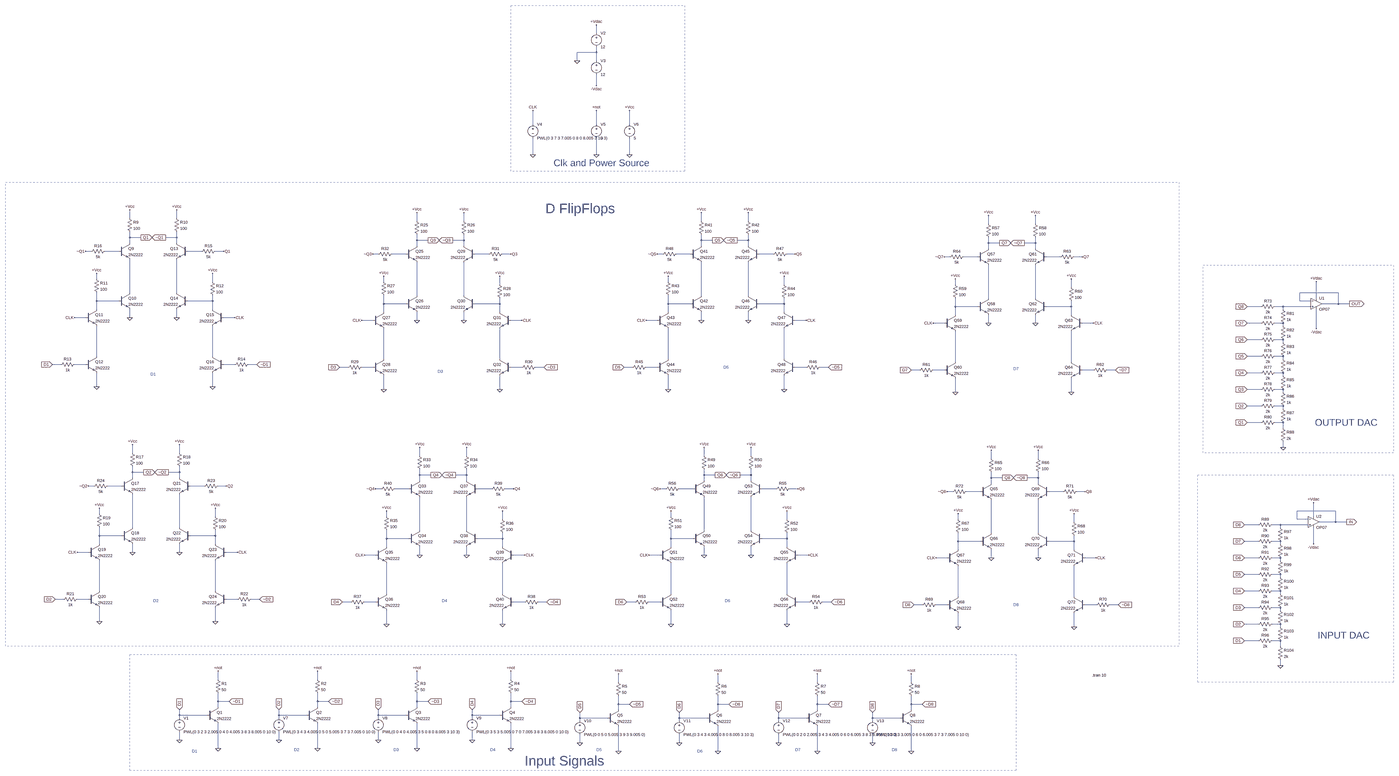
[diagram p0: schematic Memory_8Bits_FINAL.asc, whole sheet]
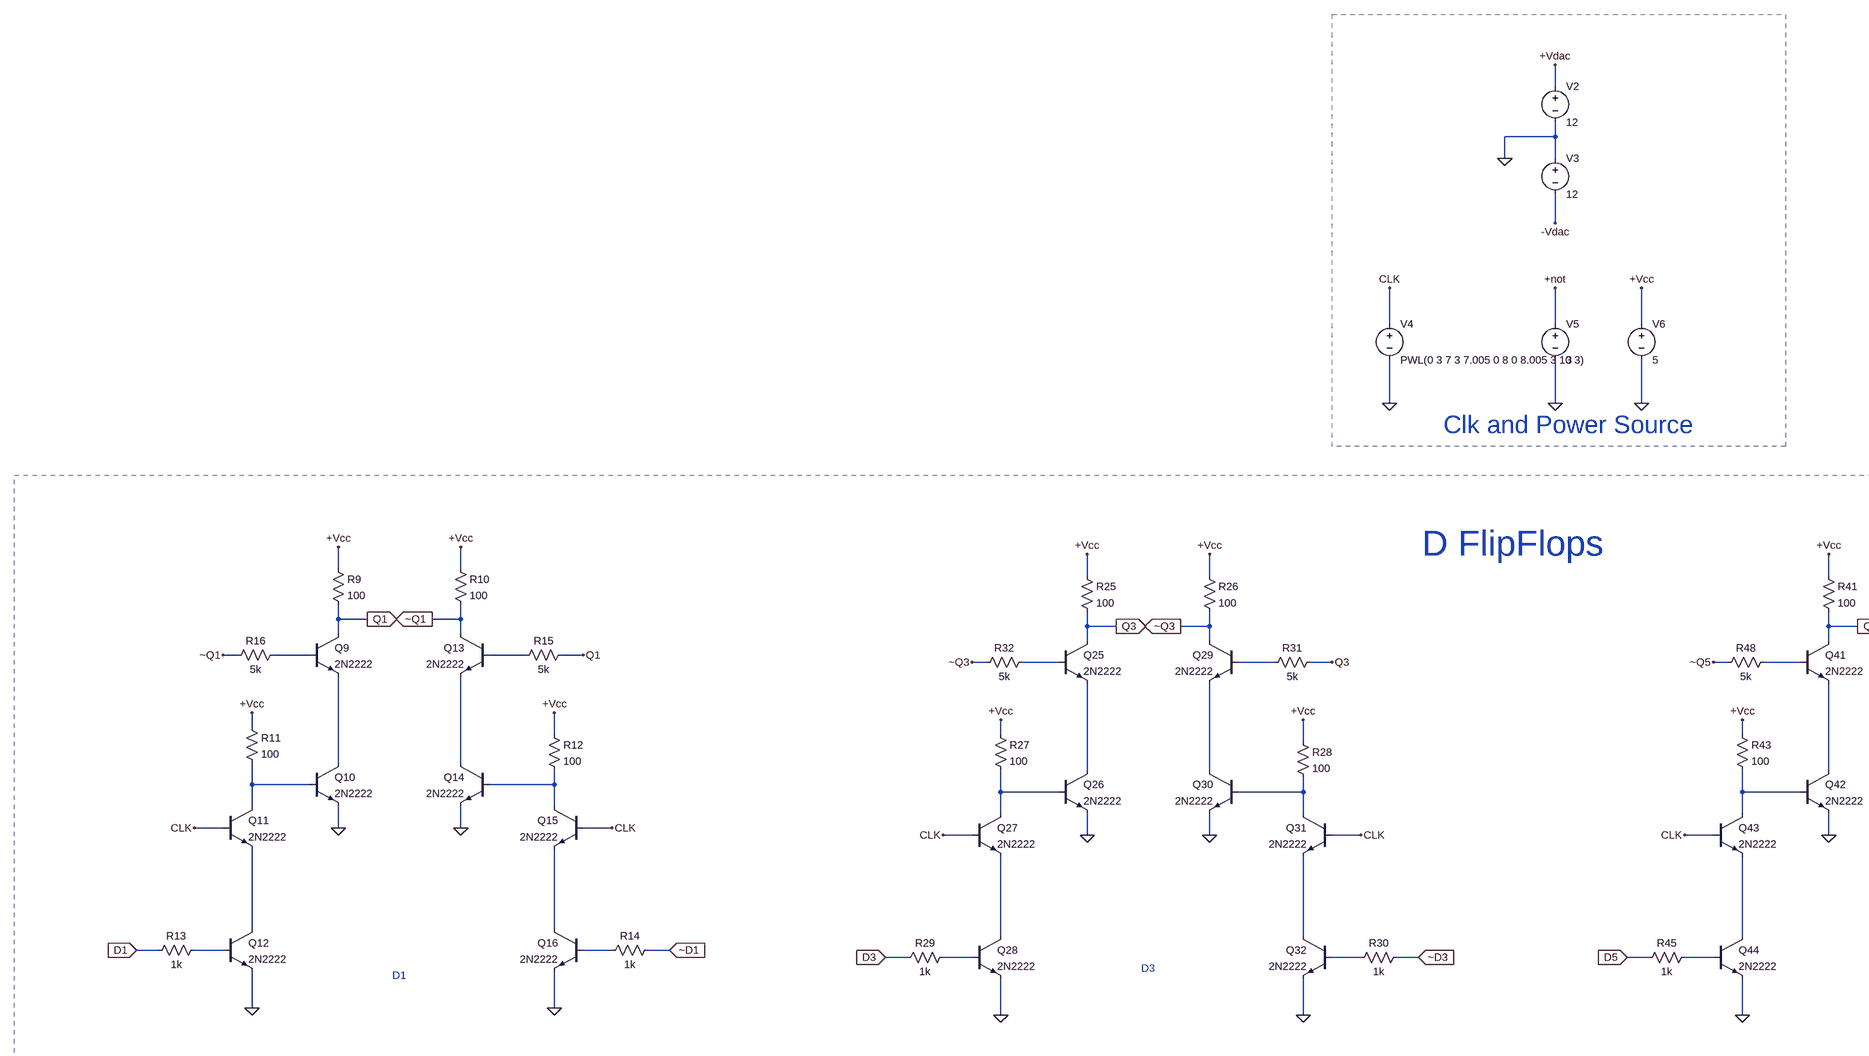
[diagram p1: schematic Memory_8Bits_FINAL.asc, part, row 1 of 2, column 1 of 2]
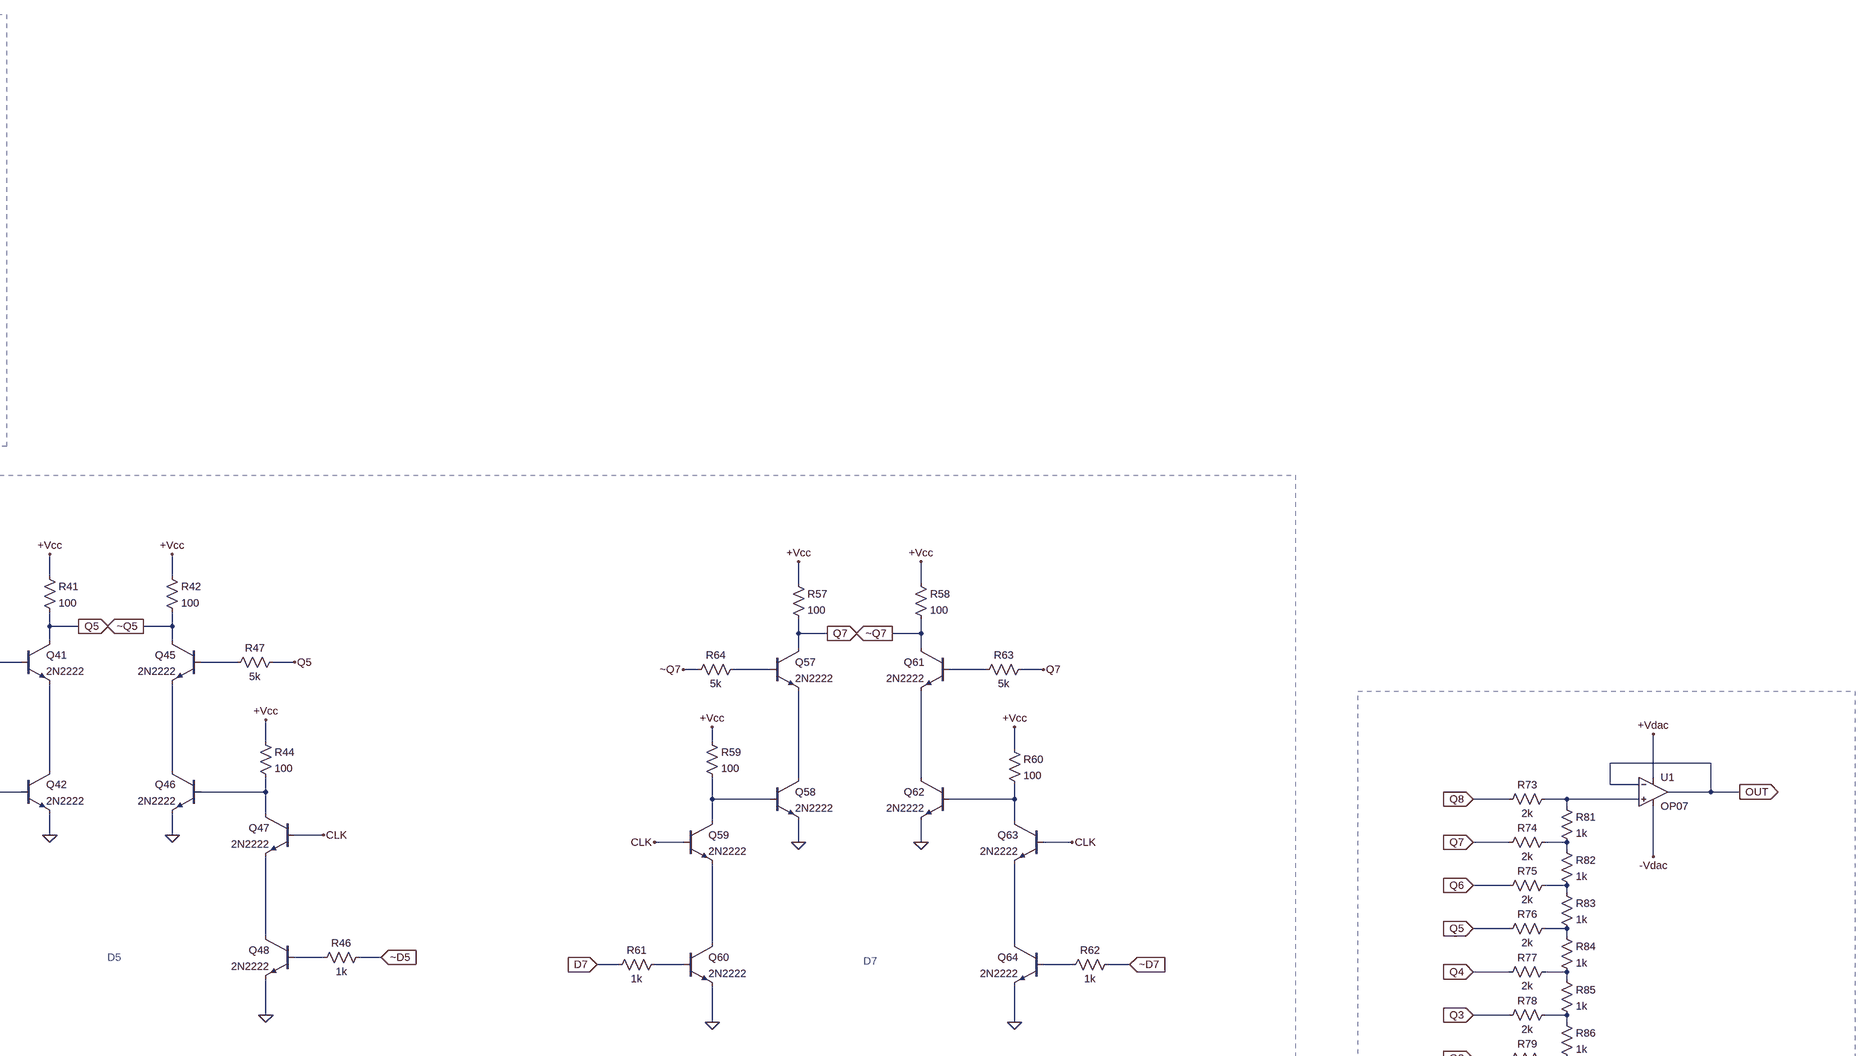
[diagram p2: schematic Memory_8Bits_FINAL.asc, part, row 1 of 2, column 2 of 2]
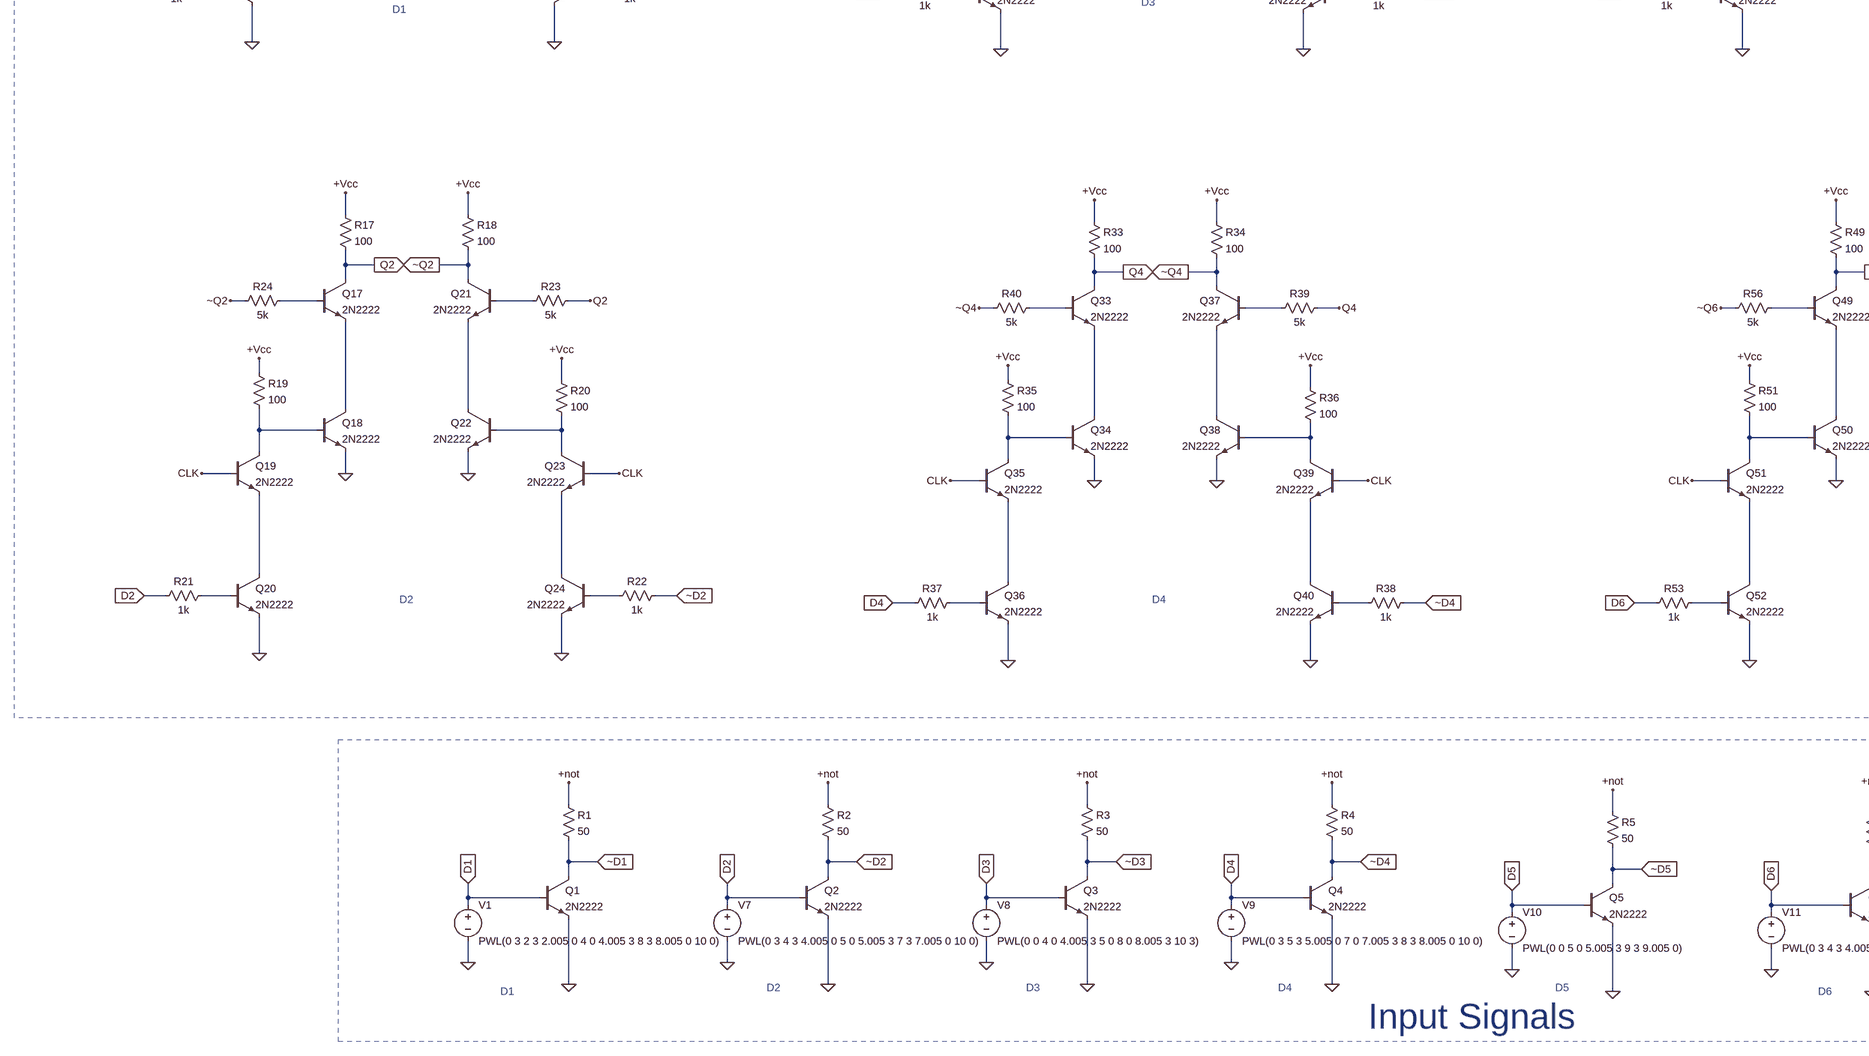
[diagram p3: schematic Memory_8Bits_FINAL.asc, part, row 2 of 2, column 1 of 2]
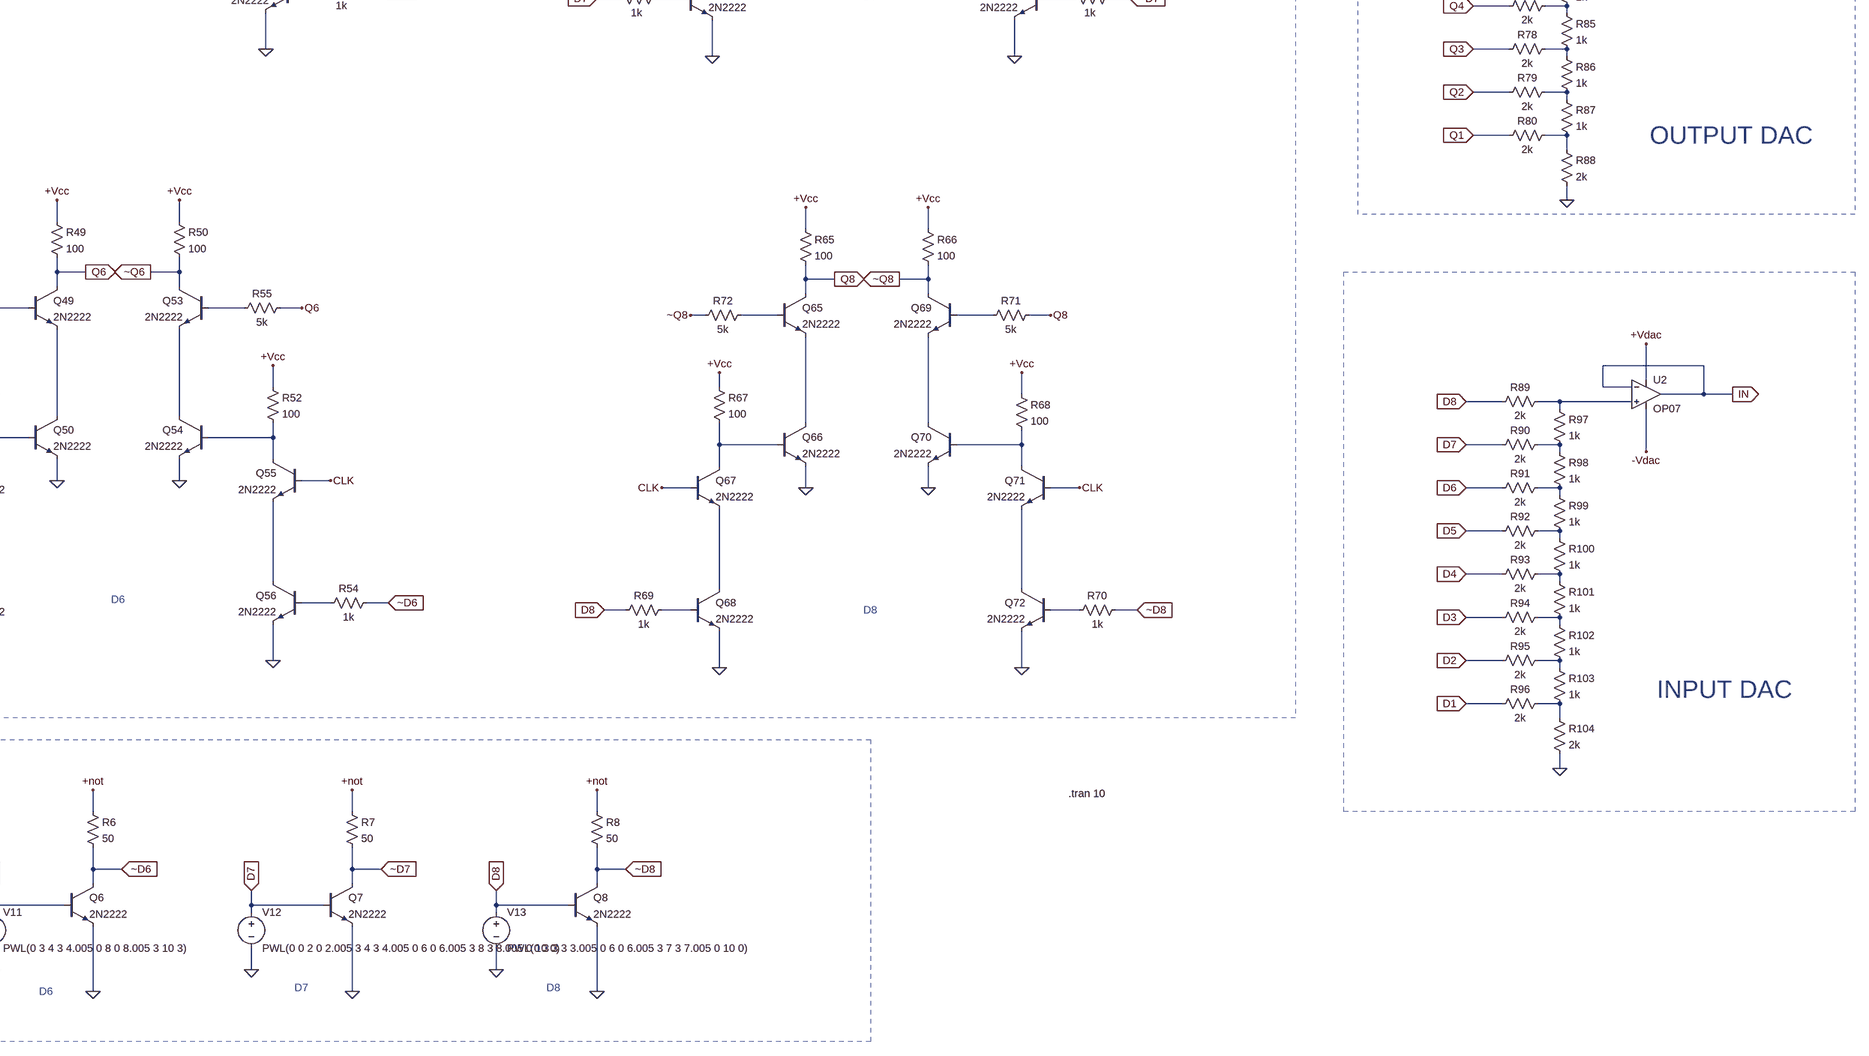
[diagram p4: schematic Memory_8Bits_FINAL.asc, part, row 2 of 2, column 2 of 2]
Memory_8Bits_FINAL.asc, the LTspice schematic file:
Version 4
SHEET 1 6340 4508
WIRE 1552 -160 1552 -208
WIRE 1552 -48 1552 -80
WIRE 1552 -48 1440 -48
WIRE 1440 0 1440 -48
WIRE 1552 0 1552 -48
WIRE 1552 144 1552 80
WIRE 1184 368 1184 288
WIRE 1552 368 1552 288
WIRE 1744 368 1744 288
WIRE 1184 544 1184 448
WIRE 1552 544 1552 448
WIRE 1744 544 1744 448
WIRE -1152 912 -1152 864
WIRE -880 912 -880 864
WIRE 512 928 512 880
WIRE 784 928 784 880
WIRE 2160 928 2160 880
WIRE 2432 928 2432 880
WIRE 3824 944 3824 896
WIRE 4096 944 4096 896
WIRE -1152 1024 -1152 992
WIRE -1088 1024 -1152 1024
WIRE -880 1024 -880 992
WIRE -880 1024 -944 1024
WIRE 512 1040 512 1008
WIRE 576 1040 512 1040
WIRE 784 1040 784 1008
WIRE 784 1040 720 1040
WIRE 2160 1040 2160 1008
WIRE 2224 1040 2160 1040
WIRE 2432 1040 2432 1008
WIRE 2432 1040 2368 1040
WIRE -1152 1056 -1152 1024
WIRE -880 1056 -880 1024
WIRE 3824 1056 3824 1024
WIRE 3888 1056 3824 1056
WIRE 4096 1056 4096 1024
WIRE 4096 1056 4032 1056
WIRE 512 1072 512 1040
WIRE 784 1072 784 1040
WIRE 2160 1072 2160 1040
WIRE 2432 1072 2432 1040
WIRE 3824 1088 3824 1056
WIRE 4096 1088 4096 1056
WIRE -1376 1104 -1408 1104
WIRE -1216 1104 -1296 1104
WIRE -736 1104 -816 1104
WIRE -608 1104 -656 1104
WIRE 288 1120 256 1120
WIRE 448 1120 368 1120
WIRE 928 1120 848 1120
WIRE 1056 1120 1008 1120
WIRE 1936 1120 1904 1120
WIRE 2096 1120 2016 1120
WIRE 2576 1120 2496 1120
WIRE 2704 1120 2656 1120
WIRE 3600 1136 3568 1136
WIRE 3760 1136 3680 1136
WIRE 4240 1136 4160 1136
WIRE 4368 1136 4320 1136
WIRE -1344 1264 -1344 1232
WIRE -672 1280 -672 1232
WIRE 320 1280 320 1248
WIRE 1968 1280 1968 1248
WIRE 992 1296 992 1248
WIRE 2640 1296 2640 1248
WIRE 3632 1296 3632 1264
WIRE 4304 1312 4304 1264
WIRE -1152 1344 -1152 1152
WIRE -880 1344 -880 1152
WIRE 5968 1344 5744 1344
WIRE 512 1360 512 1168
WIRE 784 1360 784 1168
WIRE 2160 1360 2160 1168
WIRE 2432 1360 2432 1168
WIRE 3824 1376 3824 1184
WIRE 4096 1376 4096 1184
WIRE 5840 1376 5840 1280
WIRE -1344 1392 -1344 1344
WIRE -1216 1392 -1344 1392
WIRE -672 1392 -672 1360
WIRE -672 1392 -816 1392
WIRE 5744 1392 5744 1344
WIRE 5808 1392 5744 1392
WIRE 320 1408 320 1360
WIRE 448 1408 320 1408
WIRE 992 1408 992 1376
WIRE 992 1408 848 1408
WIRE 1968 1408 1968 1360
WIRE 2096 1408 1968 1408
WIRE 2640 1408 2640 1376
WIRE 2640 1408 2496 1408
WIRE 5968 1408 5968 1344
WIRE 5968 1408 5872 1408
WIRE 6032 1408 5968 1408
WIRE 3632 1424 3632 1376
WIRE 3760 1424 3632 1424
WIRE 4304 1424 4304 1392
WIRE 4304 1424 4160 1424
WIRE 5520 1424 5440 1424
WIRE 5648 1424 5600 1424
WIRE 5808 1424 5648 1424
WIRE -1344 1440 -1344 1392
WIRE -672 1440 -672 1392
WIRE 5648 1440 5648 1424
WIRE 320 1456 320 1408
WIRE 992 1456 992 1408
WIRE 1968 1456 1968 1408
WIRE 2640 1456 2640 1408
WIRE 3632 1472 3632 1424
WIRE 4304 1472 4304 1424
WIRE -1408 1488 -1472 1488
WIRE -1152 1488 -1152 1440
WIRE -880 1488 -880 1440
WIRE -544 1488 -608 1488
WIRE 256 1504 192 1504
WIRE 512 1504 512 1456
WIRE 784 1504 784 1456
WIRE 1120 1504 1056 1504
WIRE 1904 1504 1840 1504
WIRE 2160 1504 2160 1456
WIRE 2432 1504 2432 1456
WIRE 2768 1504 2704 1504
WIRE 3568 1520 3504 1520
WIRE 3824 1520 3824 1472
WIRE 4096 1520 4096 1472
WIRE 4432 1520 4368 1520
WIRE 5520 1520 5440 1520
WIRE 5648 1520 5600 1520
WIRE 5648 1536 5648 1520
WIRE 5840 1552 5840 1440
WIRE 5520 1616 5440 1616
WIRE 5648 1616 5600 1616
WIRE 5648 1632 5648 1616
WIRE -1344 1712 -1344 1536
WIRE -672 1712 -672 1536
WIRE 5520 1712 5440 1712
WIRE 5648 1712 5600 1712
WIRE 320 1728 320 1552
WIRE 992 1728 992 1552
WIRE 1968 1728 1968 1552
WIRE 2640 1728 2640 1552
WIRE 5648 1728 5648 1712
WIRE 3632 1744 3632 1568
WIRE 4304 1744 4304 1568
WIRE -1552 1760 -1600 1760
WIRE -1408 1760 -1472 1760
WIRE -544 1760 -608 1760
WIRE -416 1760 -464 1760
WIRE 112 1776 64 1776
WIRE 256 1776 192 1776
WIRE 1120 1776 1056 1776
WIRE 1248 1776 1200 1776
WIRE 1760 1776 1712 1776
WIRE 1904 1776 1840 1776
WIRE 2768 1776 2704 1776
WIRE 2896 1776 2848 1776
WIRE 3424 1792 3376 1792
WIRE 3568 1792 3504 1792
WIRE 4432 1792 4368 1792
WIRE 4560 1792 4512 1792
WIRE 5520 1808 5440 1808
WIRE 5648 1808 5600 1808
WIRE 5648 1824 5648 1808
WIRE -1344 1888 -1344 1808
WIRE -672 1888 -672 1808
WIRE 320 1904 320 1824
WIRE 992 1904 992 1824
WIRE 1968 1904 1968 1824
WIRE 2640 1904 2640 1824
WIRE 5520 1904 5440 1904
WIRE 5648 1904 5600 1904
WIRE 3632 1920 3632 1840
WIRE 4304 1920 4304 1840
WIRE 5648 1920 5648 1904
WIRE 5520 2000 5440 2000
WIRE 5648 2000 5600 2000
WIRE 5648 2016 5648 2000
WIRE 5520 2096 5440 2096
WIRE 5648 2096 5600 2096
WIRE 5648 2128 5648 2096
WIRE 5648 2240 5648 2208
WIRE -1136 2272 -1136 2224
WIRE -864 2272 -864 2224
WIRE 528 2288 528 2240
WIRE 800 2288 800 2240
WIRE 2176 2288 2176 2240
WIRE 2448 2288 2448 2240
WIRE 3840 2304 3840 2256
WIRE 4112 2304 4112 2256
WIRE -1136 2384 -1136 2352
WIRE -1072 2384 -1136 2384
WIRE -864 2384 -864 2352
WIRE -864 2384 -928 2384
WIRE 528 2400 528 2368
WIRE 592 2400 528 2400
WIRE 800 2400 800 2368
WIRE 800 2400 736 2400
WIRE 2176 2400 2176 2368
WIRE 2240 2400 2176 2400
WIRE 2448 2400 2448 2368
WIRE 2448 2400 2384 2400
WIRE -1136 2416 -1136 2384
WIRE -864 2416 -864 2384
WIRE 3840 2416 3840 2384
WIRE 3904 2416 3840 2416
WIRE 4112 2416 4112 2384
WIRE 4112 2416 4048 2416
WIRE 528 2432 528 2400
WIRE 800 2432 800 2400
WIRE 2176 2432 2176 2400
WIRE 2448 2432 2448 2400
WIRE 3840 2448 3840 2416
WIRE 4112 2448 4112 2416
WIRE -1360 2464 -1392 2464
WIRE -1200 2464 -1280 2464
WIRE -720 2464 -800 2464
WIRE -592 2464 -640 2464
WIRE 304 2480 272 2480
WIRE 464 2480 384 2480
WIRE 944 2480 864 2480
WIRE 1072 2480 1024 2480
WIRE 1952 2480 1920 2480
WIRE 2112 2480 2032 2480
WIRE 2592 2480 2512 2480
WIRE 2720 2480 2672 2480
WIRE 3616 2496 3584 2496
WIRE 3776 2496 3696 2496
WIRE 4256 2496 4176 2496
WIRE 4384 2496 4336 2496
WIRE 5952 2608 5728 2608
WIRE -1328 2624 -1328 2592
WIRE -656 2640 -656 2592
WIRE 336 2640 336 2608
WIRE 1984 2640 1984 2608
WIRE 5824 2640 5824 2560
WIRE 1008 2656 1008 2608
WIRE 2656 2656 2656 2608
WIRE 3648 2656 3648 2624
WIRE 5728 2656 5728 2608
WIRE 5792 2656 5728 2656
WIRE 4320 2672 4320 2624
WIRE 5952 2672 5952 2608
WIRE 5952 2672 5856 2672
WIRE 6016 2672 5952 2672
WIRE 5504 2688 5424 2688
WIRE 5632 2688 5584 2688
WIRE 5792 2688 5632 2688
WIRE -1136 2704 -1136 2512
WIRE -864 2704 -864 2512
WIRE 5632 2704 5632 2688
WIRE 528 2720 528 2528
WIRE 800 2720 800 2528
WIRE 2176 2720 2176 2528
WIRE 2448 2720 2448 2528
WIRE 3840 2736 3840 2544
WIRE 4112 2736 4112 2544
WIRE -1328 2752 -1328 2704
WIRE -1200 2752 -1328 2752
WIRE -656 2752 -656 2720
WIRE -656 2752 -800 2752
WIRE 336 2768 336 2720
WIRE 464 2768 336 2768
WIRE 1008 2768 1008 2736
WIRE 1008 2768 864 2768
WIRE 1984 2768 1984 2720
WIRE 2112 2768 1984 2768
WIRE 2656 2768 2656 2736
WIRE 2656 2768 2512 2768
WIRE 3648 2784 3648 2736
WIRE 3776 2784 3648 2784
WIRE 4320 2784 4320 2752
WIRE 4320 2784 4176 2784
WIRE 5504 2784 5424 2784
WIRE 5632 2784 5584 2784
WIRE -1328 2800 -1328 2752
WIRE -656 2800 -656 2752
WIRE 5632 2800 5632 2784
WIRE 5824 2800 5824 2704
WIRE 336 2816 336 2768
WIRE 1008 2816 1008 2768
WIRE 1984 2816 1984 2768
WIRE 2656 2816 2656 2768
WIRE 3648 2832 3648 2784
WIRE 4320 2832 4320 2784
WIRE -1392 2848 -1456 2848
WIRE -1136 2848 -1136 2800
WIRE -864 2848 -864 2800
WIRE -528 2848 -592 2848
WIRE 272 2864 208 2864
WIRE 528 2864 528 2816
WIRE 800 2864 800 2816
WIRE 1136 2864 1072 2864
WIRE 1920 2864 1856 2864
WIRE 2176 2864 2176 2816
WIRE 2448 2864 2448 2816
WIRE 2784 2864 2720 2864
WIRE 3584 2880 3520 2880
WIRE 3840 2880 3840 2832
WIRE 4112 2880 4112 2832
WIRE 4448 2880 4384 2880
WIRE 5504 2880 5424 2880
WIRE 5632 2880 5584 2880
WIRE 5632 2896 5632 2880
WIRE 5504 2976 5424 2976
WIRE 5632 2976 5584 2976
WIRE 5632 2992 5632 2976
WIRE -1328 3072 -1328 2896
WIRE -656 3072 -656 2896
WIRE 5504 3072 5424 3072
WIRE 5632 3072 5584 3072
WIRE 336 3088 336 2912
WIRE 1008 3088 1008 2912
WIRE 1984 3088 1984 2912
WIRE 2656 3088 2656 2912
WIRE 5632 3088 5632 3072
WIRE 3648 3104 3648 2928
WIRE 4320 3104 4320 2928
WIRE -1536 3120 -1584 3120
WIRE -1392 3120 -1456 3120
WIRE -528 3120 -592 3120
WIRE -400 3120 -448 3120
WIRE 128 3136 80 3136
WIRE 272 3136 208 3136
WIRE 1136 3136 1072 3136
WIRE 1264 3136 1216 3136
WIRE 1776 3136 1728 3136
WIRE 1920 3136 1856 3136
WIRE 2784 3136 2720 3136
WIRE 2912 3136 2864 3136
WIRE 3440 3152 3392 3152
WIRE 3584 3152 3520 3152
WIRE 4448 3152 4384 3152
WIRE 4576 3152 4528 3152
WIRE 5504 3168 5424 3168
WIRE 5632 3168 5584 3168
WIRE 5632 3184 5632 3168
WIRE -1328 3248 -1328 3168
WIRE -656 3248 -656 3168
WIRE 336 3264 336 3184
WIRE 1008 3264 1008 3184
WIRE 1984 3264 1984 3184
WIRE 2656 3264 2656 3184
WIRE 5504 3264 5424 3264
WIRE 5632 3264 5584 3264
WIRE 3648 3280 3648 3200
WIRE 4320 3280 4320 3200
WIRE 5632 3280 5632 3264
WIRE 5504 3360 5424 3360
WIRE 5632 3360 5584 3360
WIRE 5632 3392 5632 3360
WIRE 5632 3504 5632 3472
WIRE -640 3584 -640 3536
WIRE -64 3584 -64 3536
WIRE 512 3584 512 3536
WIRE 1056 3584 1056 3536
WIRE 1680 3600 1680 3552
WIRE 2256 3600 2256 3552
WIRE 2832 3600 2832 3552
WIRE 3376 3600 3376 3552
WIRE -640 3712 -640 3664
WIRE -576 3712 -640 3712
WIRE -64 3712 -64 3664
WIRE 0 3712 -64 3712
WIRE 512 3712 512 3664
WIRE 576 3712 512 3712
WIRE 1056 3712 1056 3664
WIRE 1120 3712 1056 3712
WIRE 1680 3728 1680 3680
WIRE 1744 3728 1680 3728
WIRE 2256 3728 2256 3680
WIRE 2320 3728 2256 3728
WIRE 2832 3728 2832 3680
WIRE 2896 3728 2832 3728
WIRE 3376 3728 3376 3680
WIRE 3440 3728 3376 3728
WIRE -640 3744 -640 3712
WIRE -64 3744 -64 3712
WIRE 512 3744 512 3712
WIRE 1056 3744 1056 3712
WIRE 1680 3760 1680 3728
WIRE 2256 3760 2256 3728
WIRE 2832 3760 2832 3728
WIRE 3376 3760 3376 3728
WIRE -864 3792 -864 3760
WIRE -704 3792 -864 3792
WIRE -288 3792 -288 3760
WIRE -128 3792 -288 3792
WIRE 288 3792 288 3760
WIRE 448 3792 288 3792
WIRE 832 3792 832 3760
WIRE 992 3792 832 3792
WIRE -864 3808 -864 3792
WIRE -288 3808 -288 3792
WIRE 288 3808 288 3792
WIRE 832 3808 832 3792
WIRE 1456 3808 1456 3776
WIRE 1616 3808 1456 3808
WIRE 2032 3808 2032 3776
WIRE 2192 3808 2032 3808
WIRE 2608 3808 2608 3776
WIRE 2768 3808 2608 3808
WIRE 3152 3808 3152 3776
WIRE 3312 3808 3152 3808
WIRE 1456 3824 1456 3808
WIRE 2032 3824 2032 3808
WIRE 2608 3824 2608 3808
WIRE 3152 3824 3152 3808
WIRE -864 3936 -864 3888
WIRE -288 3936 -288 3888
WIRE 288 3936 288 3888
WIRE 832 3936 832 3888
WIRE 1456 3952 1456 3904
WIRE 2032 3952 2032 3904
WIRE 2608 3952 2608 3904
WIRE 3152 3952 3152 3904
WIRE -640 3984 -640 3840
WIRE -64 3984 -64 3840
WIRE 512 3984 512 3840
WIRE 1056 3984 1056 3840
WIRE 1680 4000 1680 3856
WIRE 2256 4000 2256 3856
WIRE 2832 4000 2832 3856
WIRE 3376 4000 3376 3856
FLAG -640 3984 0
FLAG -864 3936 0
FLAG 1440 0 0
FLAG 1552 -208 +Vdac
FLAG 1552 144 -Vdac
FLAG 1184 544 0
FLAG 1552 544 0
FLAG 1744 544 0
FLAG 1184 288 CLK
FLAG 1552 288 +not
FLAG 1744 288 +Vcc
FLAG -640 3536 +not
FLAG -864 3760 D1
IOPIN -864 3760 In
FLAG -576 3712 ~D1
IOPIN -576 3712 In
FLAG -64 3984 0
FLAG -288 3936 0
FLAG -64 3536 +not
FLAG -288 3760 D2
IOPIN -288 3760 In
FLAG 0 3712 ~D2
IOPIN 0 3712 In
FLAG 512 3984 0
FLAG 288 3936 0
FLAG 512 3536 +not
FLAG 288 3760 D3
IOPIN 288 3760 In
FLAG 576 3712 ~D3
IOPIN 576 3712 In
FLAG 1056 3984 0
FLAG 832 3936 0
FLAG 1056 3536 +not
FLAG 832 3760 D4
IOPIN 832 3760 In
FLAG 1120 3712 ~D4
IOPIN 1120 3712 In
FLAG 1680 4000 0
FLAG 1456 3952 0
FLAG 1680 3552 +not
FLAG 1456 3776 D5
IOPIN 1456 3776 In
FLAG 1744 3728 ~D5
IOPIN 1744 3728 In
FLAG 2256 4000 0
FLAG 2032 3952 0
FLAG 2256 3552 +not
FLAG 2032 3776 D6
IOPIN 2032 3776 In
FLAG 2320 3728 ~D6
IOPIN 2320 3728 In
FLAG 2832 4000 0
FLAG 2608 3952 0
FLAG 2832 3552 +not
FLAG 2608 3776 D7
IOPIN 2608 3776 In
FLAG 2896 3728 ~D7
IOPIN 2896 3728 In
FLAG 3376 4000 0
FLAG 3152 3952 0
FLAG 3376 3552 +not
FLAG 3152 3776 D8
IOPIN 3152 3776 In
FLAG 3440 3728 ~D8
IOPIN 3440 3728 In
FLAG -1152 1488 0
FLAG -880 1488 0
FLAG -1344 1888 0
FLAG -672 1888 0
FLAG -1344 1232 +Vcc
FLAG -1152 864 +Vcc
FLAG -880 864 +Vcc
FLAG -672 1232 +Vcc
FLAG -1600 1760 D1
IOPIN -1600 1760 In
FLAG -416 1760 ~D1
IOPIN -416 1760 In
FLAG -1472 1488 CLK
FLAG -544 1488 CLK
FLAG -1088 1024 Q1
IOPIN -1088 1024 Out
FLAG -944 1024 ~Q1
IOPIN -944 1024 Out
FLAG -1408 1104 ~Q1
FLAG -608 1104 Q1
FLAG -1136 2848 0
FLAG -864 2848 0
FLAG -1328 3248 0
FLAG -656 3248 0
FLAG -1328 2592 +Vcc
FLAG -1136 2224 +Vcc
FLAG -864 2224 +Vcc
FLAG -656 2592 +Vcc
FLAG -1584 3120 D2
IOPIN -1584 3120 In
FLAG -400 3120 ~D2
IOPIN -400 3120 In
FLAG -1456 2848 CLK
FLAG -528 2848 CLK
FLAG -1072 2384 Q2
IOPIN -1072 2384 Out
FLAG -928 2384 ~Q2
IOPIN -928 2384 Out
FLAG -1392 2464 ~Q2
FLAG -592 2464 Q2
FLAG 512 1504 0
FLAG 784 1504 0
FLAG 320 1904 0
FLAG 992 1904 0
FLAG 320 1248 +Vcc
FLAG 512 880 +Vcc
FLAG 784 880 +Vcc
FLAG 992 1248 +Vcc
FLAG 64 1776 D3
IOPIN 64 1776 In
FLAG 1248 1776 ~D3
IOPIN 1248 1776 In
FLAG 192 1504 CLK
FLAG 1120 1504 CLK
FLAG 576 1040 Q3
IOPIN 576 1040 Out
FLAG 720 1040 ~Q3
IOPIN 720 1040 Out
FLAG 256 1120 ~Q3
FLAG 1056 1120 Q3
FLAG 528 2864 0
FLAG 800 2864 0
FLAG 336 3264 0
FLAG 1008 3264 0
FLAG 336 2608 +Vcc
FLAG 528 2240 +Vcc
FLAG 800 2240 +Vcc
FLAG 1008 2608 +Vcc
FLAG 80 3136 D4
IOPIN 80 3136 In
FLAG 1264 3136 ~D4
IOPIN 1264 3136 In
FLAG 208 2864 CLK
FLAG 1136 2864 CLK
FLAG 592 2400 Q4
IOPIN 592 2400 Out
FLAG 736 2400 ~Q4
IOPIN 736 2400 Out
FLAG 272 2480 ~Q4
FLAG 1072 2480 Q4
FLAG 2160 1504 0
FLAG 2432 1504 0
FLAG 1968 1904 0
FLAG 2640 1904 0
FLAG 1968 1248 +Vcc
FLAG 2160 880 +Vcc
FLAG 2432 880 +Vcc
FLAG 2640 1248 +Vcc
FLAG 1712 1776 D5
IOPIN 1712 1776 In
FLAG 2896 1776 ~D5
IOPIN 2896 1776 In
FLAG 1840 1504 CLK
FLAG 2768 1504 CLK
FLAG 2224 1040 Q5
IOPIN 2224 1040 Out
FLAG 2368 1040 ~Q5
IOPIN 2368 1040 Out
FLAG 1904 1120 ~Q5
FLAG 2704 1120 Q5
FLAG 2176 2864 0
FLAG 2448 2864 0
FLAG 1984 3264 0
FLAG 2656 3264 0
FLAG 1984 2608 +Vcc
FLAG 2176 2240 +Vcc
FLAG 2448 2240 +Vcc
FLAG 2656 2608 +Vcc
FLAG 1728 3136 D6
IOPIN 1728 3136 In
FLAG 2912 3136 ~D6
IOPIN 2912 3136 In
FLAG 1856 2864 CLK
FLAG 2784 2864 CLK
FLAG 2240 2400 Q6
IOPIN 2240 2400 Out
FLAG 2384 2400 ~Q6
IOPIN 2384 2400 Out
FLAG 1920 2480 ~Q6
FLAG 2720 2480 Q6
FLAG 3824 1520 0
FLAG 4096 1520 0
FLAG 3632 1920 0
FLAG 4304 1920 0
FLAG 3632 1264 +Vcc
FLAG 3824 896 +Vcc
FLAG 4096 896 +Vcc
FLAG 4304 1264 +Vcc
FLAG 3376 1792 D7
IOPIN 3376 1792 In
FLAG 4560 1792 ~D7
IOPIN 4560 1792 In
FLAG 3504 1520 CLK
FLAG 4432 1520 CLK
FLAG 3888 1056 Q7
IOPIN 3888 1056 Out
FLAG 4032 1056 ~Q7
IOPIN 4032 1056 Out
FLAG 3568 1136 ~Q7
FLAG 4368 1136 Q7
FLAG 3840 2880 0
FLAG 4112 2880 0
FLAG 3648 3280 0
FLAG 4320 3280 0
FLAG 3648 2624 +Vcc
FLAG 3840 2256 +Vcc
FLAG 4112 2256 +Vcc
FLAG 4320 2624 +Vcc
FLAG 3392 3152 D8
IOPIN 3392 3152 In
FLAG 4576 3152 ~D8
IOPIN 4576 3152 In
FLAG 3520 2880 CLK
FLAG 4448 2880 CLK
FLAG 3904 2416 Q8
IOPIN 3904 2416 Out
FLAG 4048 2416 ~Q8
IOPIN 4048 2416 Out
FLAG 3584 2496 ~Q8
FLAG 4384 2496 Q8
FLAG 5840 1280 +Vdac
FLAG 5824 2560 +Vdac
FLAG 5840 1552 -Vdac
FLAG 5824 2800 -Vdac
FLAG 6016 2672 IN
IOPIN 6016 2672 Out
FLAG 6032 1408 OUT
IOPIN 6032 1408 Out
FLAG 5648 2240 0
FLAG 5440 2096 Q1
IOPIN 5440 2096 In
FLAG 5440 2000 Q2
IOPIN 5440 2000 In
FLAG 5440 1904 Q3
IOPIN 5440 1904 In
FLAG 5440 1808 Q4
IOPIN 5440 1808 In
FLAG 5440 1712 Q5
IOPIN 5440 1712 In
FLAG 5440 1616 Q6
IOPIN 5440 1616 In
FLAG 5440 1520 Q7
IOPIN 5440 1520 In
FLAG 5440 1424 Q8
IOPIN 5440 1424 In
FLAG 5632 3504 0
FLAG 5424 3360 D1
IOPIN 5424 3360 In
FLAG 5424 3264 D2
IOPIN 5424 3264 In
FLAG 5424 3168 D3
IOPIN 5424 3168 In
FLAG 5424 3072 D4
IOPIN 5424 3072 In
FLAG 5424 2976 D5
IOPIN 5424 2976 In
FLAG 5424 2880 D6
IOPIN 5424 2880 In
FLAG 5424 2784 D7
IOPIN 5424 2784 In
FLAG 5424 2688 D8
IOPIN 5424 2688 In
SYMBOL npn -704 3744 R0
SYMATTR InstName Q1
SYMATTR Value 2N2222
SYMBOL res -656 3568 R0
SYMATTR InstName R1
SYMATTR Value 50
SYMBOL voltage -864 3792 R0
WINDOW 123 0 0 Left 0
WINDOW 39 0 0 Left 0
SYMATTR InstName V1
SYMATTR Value PWL(0 3 2 3 2.005 0 4 0 4.005 3 8 3 8.005 0 10 0)
SYMBOL voltage 1552 -176 R0
WINDOW 123 0 0 Left 0
WINDOW 39 0 0 Left 0
SYMATTR InstName V2
SYMATTR Value 12
SYMBOL voltage 1552 -16 R0
WINDOW 123 0 0 Left 0
WINDOW 39 0 0 Left 0
SYMATTR InstName V3
SYMATTR Value 12
SYMBOL voltage 1184 352 R0
WINDOW 123 0 0 Left 0
WINDOW 39 0 0 Left 0
SYMATTR InstName V4
SYMATTR Value PWL(0 3 7 3 7.005 0 8 0 8.005 3 10 3)
SYMBOL voltage 1552 352 R0
WINDOW 123 0 0 Left 0
WINDOW 39 0 0 Left 0
SYMATTR InstName V5
SYMATTR Value 3
SYMBOL voltage 1744 352 R0
WINDOW 123 0 0 Left 0
WINDOW 39 0 0 Left 0
SYMATTR InstName V6
SYMATTR Value 5
SYMBOL npn -128 3744 R0
SYMATTR InstName Q2
SYMATTR Value 2N2222
SYMBOL res -80 3568 R0
SYMATTR InstName R2
SYMATTR Value 50
SYMBOL voltage -288 3792 R0
WINDOW 123 0 0 Left 0
WINDOW 39 0 0 Left 0
SYMATTR InstName V7
SYMATTR Value PWL(0 3 4 3 4.005 0 5 0 5.005 3 7 3 7.005 0 10 0)
SYMBOL npn 448 3744 R0
SYMATTR InstName Q3
SYMATTR Value 2N2222
SYMBOL res 496 3568 R0
SYMATTR InstName R3
SYMATTR Value 50
SYMBOL voltage 288 3792 R0
WINDOW 123 0 0 Left 0
WINDOW 39 0 0 Left 0
SYMATTR InstName V8
SYMATTR Value PWL(0 0 4 0 4.005 3 5 0 8 0 8.005 3 10 3)
SYMBOL npn 992 3744 R0
SYMATTR InstName Q4
SYMATTR Value 2N2222
SYMBOL res 1040 3568 R0
SYMATTR InstName R4
SYMATTR Value 50
SYMBOL voltage 832 3792 R0
WINDOW 123 0 0 Left 0
WINDOW 39 0 0 Left 0
SYMATTR InstName V9
SYMATTR Value PWL(0 3 5 3 5.005 0 7 0 7.005 3 8 3 8.005 0 10 0)
SYMBOL npn 1616 3760 R0
SYMATTR InstName Q5
SYMATTR Value 2N2222
SYMBOL res 1664 3584 R0
SYMATTR InstName R5
SYMATTR Value 50
SYMBOL voltage 1456 3808 R0
WINDOW 123 0 0 Left 0
WINDOW 39 0 0 Left 0
SYMATTR InstName V10
SYMATTR Value PWL(0 0 5 0 5.005 3 9 3 9.005 0)
SYMBOL npn 2192 3760 R0
SYMATTR InstName Q6
SYMATTR Value 2N2222
SYMBOL res 2240 3584 R0
SYMATTR InstName R6
SYMATTR Value 50
SYMBOL voltage 2032 3808 R0
WINDOW 123 0 0 Left 0
WINDOW 39 0 0 Left 0
SYMATTR InstName V11
SYMATTR Value PWL(0 3 4 3 4.005 0 8 0 8.005 3 10 3)
SYMBOL npn 2768 3760 R0
SYMATTR InstName Q7
SYMATTR Value 2N2222
SYMBOL res 2816 3584 R0
SYMATTR InstName R7
SYMATTR Value 50
SYMBOL voltage 2608 3808 R0
WINDOW 123 0 0 Left 0
WINDOW 39 0 0 Left 0
SYMATTR InstName V12
SYMATTR Value PWL(0 0 2 0 2.005 3 4 3 4.005 0 6 0 6.005 3 8 3 8.005 0 10 0)
SYMBOL npn 3312 3760 R0
SYMATTR InstName Q8
SYMATTR Value 2N2222
SYMBOL res 3360 3584 R0
SYMATTR InstName R8
SYMATTR Value 50
SYMBOL voltage 3152 3808 R0
WINDOW 123 0 0 Left 0
WINDOW 39 0 0 Left 0
SYMATTR InstName V13
SYMATTR Value PWL(0 3 3 3 3.005 0 6 0 6.005 3 7 3 7.005 0 10 0)
SYMBOL npn -1216 1056 R0
SYMATTR InstName Q9
SYMATTR Value 2N2222
SYMBOL npn -1216 1344 R0
SYMATTR InstName Q10
SYMATTR Value 2N2222
SYMBOL npn -1408 1440 R0
SYMATTR InstName Q11
SYMATTR Value 2N2222
SYMBOL npn -1408 1712 R0
SYMATTR InstName Q12
SYMATTR Value 2N2222
SYMBOL npn -816 1056 M0
SYMATTR InstName Q13
SYMATTR Value 2N2222
SYMBOL npn -816 1344 M0
SYMATTR InstName Q14
SYMATTR Value 2N2222
SYMBOL npn -608 1440 M0
SYMATTR InstName Q15
SYMATTR Value 2N2222
SYMBOL npn -608 1712 M0
SYMATTR InstName Q16
SYMATTR Value 2N2222
SYMBOL res -1168 896 R0
SYMATTR InstName R9
SYMATTR Value 100
SYMBOL res -896 896 R0
SYMATTR InstName R10
SYMATTR Value 100
SYMBOL res -1360 1248 R0
SYMATTR InstName R11
SYMATTR Value 100
SYMBOL res -688 1264 R0
SYMATTR InstName R12
SYMATTR Value 100
SYMBOL res -1456 1744 R90
WINDOW 0 0 56 VBottom 2
WINDOW 3 32 56 VTop 2
SYMATTR InstName R13
SYMATTR Value 1k
SYMBOL res -448 1744 R90
WINDOW 0 0 56 VBottom 2
WINDOW 3 32 56 VTop 2
SYMATTR InstName R14
SYMATTR Value 1k
SYMBOL res -640 1088 R90
WINDOW 0 0 56 VBottom 2
WINDOW 3 32 56 VTop 2
SYMATTR InstName R15
SYMATTR Value 5k
SYMBOL res -1280 1088 R90
WINDOW 0 0 56 VBottom 2
WINDOW 3 32 56 VTop 2
SYMATTR InstName R16
SYMATTR Value 5k
SYMBOL npn -1200 2416 R0
SYMATTR InstName Q17
SYMATTR Value 2N2222
SYMBOL npn -1200 2704 R0
SYMATTR InstName Q18
SYMATTR Value 2N2222
SYMBOL npn -1392 2800 R0
SYMATTR InstName Q19
SYMATTR Value 2N2222
SYMBOL npn -1392 3072 R0
SYMATTR InstName Q20
SYMATTR Value 2N2222
SYMBOL npn -800 2416 M0
SYMATTR InstName Q21
SYMATTR Value 2N2222
SYMBOL npn -800 2704 M0
SYMATTR InstName Q22
SYMATTR Value 2N2222
SYMBOL npn -592 2800 M0
SYMATTR InstName Q23
SYMATTR Value 2N2222
SYMBOL npn -592 3072 M0
SYMATTR InstName Q24
SYMATTR Value 2N2222
SYMBOL res -1152 2256 R0
SYMATTR InstName R17
SYMATTR Value 100
SYMBOL res -880 2256 R0
SYMATTR InstName R18
SYMATTR Value 100
SYMBOL res -1344 2608 R0
SYMATTR InstName R19
SYMATTR Value 100
SYMBOL res -672 2624 R0
SYMATTR InstName R20
SYMATTR Value 100
SYMBOL res -1440 3104 R90
WINDOW 0 0 56 VBottom 2
WINDOW 3 32 56 VTop 2
SYMATTR InstName R21
SYMATTR Value 1k
SYMBOL res -432 3104 R90
WINDOW 0 0 56 VBottom 2
WINDOW 3 32 56 VTop 2
SYMATTR InstName R22
SYMATTR Value 1k
SYMBOL res -624 2448 R90
WINDOW 0 0 56 VBottom 2
WINDOW 3 32 56 VTop 2
SYMATTR InstName R23
SYMATTR Value 5k
SYMBOL res -1264 2448 R90
WINDOW 0 0 56 VBottom 2
WINDOW 3 32 56 VTop 2
SYMATTR InstName R24
SYMATTR Value 5k
SYMBOL npn 448 1072 R0
SYMATTR InstName Q25
SYMATTR Value 2N2222
SYMBOL npn 448 1360 R0
SYMATTR InstName Q26
SYMATTR Value 2N2222
SYMBOL npn 256 1456 R0
SYMATTR InstName Q27
SYMATTR Value 2N2222
SYMBOL npn 256 1728 R0
SYMATTR InstName Q28
SYMATTR Value 2N2222
SYMBOL npn 848 1072 M0
SYMATTR InstName Q29
SYMATTR Value 2N2222
SYMBOL npn 848 1360 M0
SYMATTR InstName Q30
SYMATTR Value 2N2222
SYMBOL npn 1056 1456 M0
SYMATTR InstName Q31
SYMATTR Value 2N2222
SYMBOL npn 1056 1728 M0
SYMATTR InstName Q32
SYMATTR Value 2N2222
SYMBOL res 496 912 R0
SYMATTR InstName R25
SYMATTR Value 100
SYMBOL res 768 912 R0
SYMATTR InstName R26
SYMATTR Value 100
SYMBOL res 304 1264 R0
SYMATTR InstName R27
SYMATTR Value 100
SYMBOL res 976 1280 R0
SYMATTR InstName R28
SYMATTR Value 100
SYMBOL res 208 1760 R90
WINDOW 0 0 56 VBottom 2
WINDOW 3 32 56 VTop 2
SYMATTR InstName R29
SYMATTR Value 1k
SYMBOL res 1216 1760 R90
WINDOW 0 0 56 VBottom 2
WINDOW 3 32 56 VTop 2
SYMATTR InstName R30
SYMATTR Value 1k
SYMBOL res 1024 1104 R90
WINDOW 0 0 56 VBottom 2
WINDOW 3 32 56 VTop 2
SYMATTR InstName R31
SYMATTR Value 5k
SYMBOL res 384 1104 R90
WINDOW 0 0 56 VBottom 2
WINDOW 3 32 56 VTop 2
SYMATTR InstName R32
SYMATTR Value 5k
SYMBOL npn 464 2432 R0
SYMATTR InstName Q33
SYMATTR Value 2N2222
SYMBOL npn 464 2720 R0
SYMATTR InstName Q34
SYMATTR Value 2N2222
SYMBOL npn 272 2816 R0
SYMATTR InstName Q35
SYMATTR Value 2N2222
SYMBOL npn 272 3088 R0
SYMATTR InstName Q36
SYMATTR Value 2N2222
SYMBOL npn 864 2432 M0
SYMATTR InstName Q37
SYMATTR Value 2N2222
SYMBOL npn 864 2720 M0
SYMATTR InstName Q38
SYMATTR Value 2N2222
SYMBOL npn 1072 2816 M0
SYMATTR InstName Q39
SYMATTR Value 2N2222
SYMBOL npn 1072 3088 M0
SYMATTR InstName Q40
SYMATTR Value 2N2222
SYMBOL res 512 2272 R0
SYMATTR InstName R33
SYMATTR Value 100
SYMBOL res 784 2272 R0
SYMATTR InstName R34
SYMATTR Value 100
SYMBOL res 320 2624 R0
SYMATTR InstName R35
SYMATTR Value 100
SYMBOL res 992 2640 R0
SYMATTR InstName R36
SYMATTR Value 100
SYMBOL res 224 3120 R90
WINDOW 0 0 56 VBottom 2
WINDOW 3 32 56 VTop 2
SYMATTR InstName R37
SYMATTR Value 1k
SYMBOL res 1232 3120 R90
WINDOW 0 0 56 VBottom 2
WINDOW 3 32 56 VTop 2
SYMATTR InstName R38
SYMATTR Value 1k
SYMBOL res 1040 2464 R90
WINDOW 0 0 56 VBottom 2
WINDOW 3 32 56 VTop 2
SYMATTR InstName R39
SYMATTR Value 5k
SYMBOL res 400 2464 R90
WINDOW 0 0 56 VBottom 2
WINDOW 3 32 56 VTop 2
SYMATTR InstName R40
SYMATTR Value 5k
SYMBOL npn 2096 1072 R0
SYMATTR InstName Q41
SYMATTR Value 2N2222
SYMBOL npn 2096 1360 R0
SYMATTR InstName Q42
SYMATTR Value 2N2222
SYMBOL npn 1904 1456 R0
SYMATTR InstName Q43
SYMATTR Value 2N2222
SYMBOL npn 1904 1728 R0
SYMATTR InstName Q44
SYMATTR Value 2N2222
SYMBOL npn 2496 1072 M0
SYMATTR InstName Q45
SYMATTR Value 2N2222
SYMBOL npn 2496 1360 M0
SYMATTR InstName Q46
SYMATTR Value 2N2222
SYMBOL npn 2704 1456 M0
SYMATTR InstName Q47
SYMATTR Value 2N2222
SYMBOL npn 2704 1728 M0
SYMATTR InstName Q48
SYMATTR Value 2N2222
SYMBOL res 2144 912 R0
SYMATTR InstName R41
SYMATTR Value 100
SYMBOL res 2416 912 R0
SYMATTR InstName R42
SYMATTR Value 100
SYMBOL res 1952 1264 R0
SYMATTR InstName R43
SYMATTR Value 100
SYMBOL res 2624 1280 R0
SYMATTR InstName R44
SYMATTR Value 100
SYMBOL res 1856 1760 R90
WINDOW 0 0 56 VBottom 2
WINDOW 3 32 56 VTop 2
SYMATTR InstName R45
SYMATTR Value 1k
SYMBOL res 2864 1760 R90
WINDOW 0 0 56 VBottom 2
WINDOW 3 32 56 VTop 2
SYMATTR InstName R46
SYMATTR Value 1k
SYMBOL res 2672 1104 R90
WINDOW 0 0 56 VBottom 2
WINDOW 3 32 56 VTop 2
SYMATTR InstName R47
SYMATTR Value 5k
SYMBOL res 2032 1104 R90
WINDOW 0 0 56 VBottom 2
WINDOW 3 32 56 VTop 2
SYMATTR InstName R48
SYMATTR Value 5k
SYMBOL npn 2112 2432 R0
SYMATTR InstName Q49
SYMATTR Value 2N2222
SYMBOL npn 2112 2720 R0
SYMATTR InstName Q50
SYMATTR Value 2N2222
SYMBOL npn 1920 2816 R0
SYMATTR InstName Q51
SYMATTR Value 2N2222
SYMBOL npn 1920 3088 R0
SYMATTR InstName Q52
SYMATTR Value 2N2222
SYMBOL npn 2512 2432 M0
SYMATTR InstName Q53
SYMATTR Value 2N2222
SYMBOL npn 2512 2720 M0
SYMATTR InstName Q54
SYMATTR Value 2N2222
SYMBOL npn 2720 2816 M0
SYMATTR InstName Q55
SYMATTR Value 2N2222
SYMBOL npn 2720 3088 M0
SYMATTR InstName Q56
SYMATTR Value 2N2222
SYMBOL res 2160 2272 R0
SYMATTR InstName R49
SYMATTR Value 100
SYMBOL res 2432 2272 R0
SYMATTR InstName R50
SYMATTR Value 100
SYMBOL res 1968 2624 R0
SYMATTR InstName R51
SYMATTR Value 100
SYMBOL res 2640 2640 R0
SYMATTR InstName R52
SYMATTR Value 100
SYMBOL res 1872 3120 R90
WINDOW 0 0 56 VBottom 2
WINDOW 3 32 56 VTop 2
SYMATTR InstName R53
SYMATTR Value 1k
SYMBOL res 2880 3120 R90
WINDOW 0 0 56 VBottom 2
WINDOW 3 32 56 VTop 2
SYMATTR InstName R54
SYMATTR Value 1k
SYMBOL res 2688 2464 R90
WINDOW 0 0 56 VBottom 2
WINDOW 3 32 56 VTop 2
SYMATTR InstName R55
SYMATTR Value 5k
SYMBOL res 2048 2464 R90
WINDOW 0 0 56 VBottom 2
WINDOW 3 32 56 VTop 2
SYMATTR InstName R56
SYMATTR Value 5k
SYMBOL npn 3760 1088 R0
SYMATTR InstName Q57
SYMATTR Value 2N2222
SYMBOL npn 3760 1376 R0
SYMATTR InstName Q58
SYMATTR Value 2N2222
SYMBOL npn 3568 1472 R0
SYMATTR InstName Q59
SYMATTR Value 2N2222
SYMBOL npn 3568 1744 R0
SYMATTR InstName Q60
SYMATTR Value 2N2222
SYMBOL npn 4160 1088 M0
SYMATTR InstName Q61
SYMATTR Value 2N2222
SYMBOL npn 4160 1376 M0
SYMATTR InstName Q62
SYMATTR Value 2N2222
SYMBOL npn 4368 1472 M0
SYMATTR InstName Q63
SYMATTR Value 2N2222
SYMBOL npn 4368 1744 M0
SYMATTR InstName Q64
SYMATTR Value 2N2222
SYMBOL res 3808 928 R0
SYMATTR InstName R57
SYMATTR Value 100
SYMBOL res 4080 928 R0
SYMATTR InstName R58
SYMATTR Value 100
SYMBOL res 3616 1280 R0
SYMATTR InstName R59
SYMATTR Value 100
SYMBOL res 4288 1296 R0
SYMATTR InstName R60
SYMATTR Value 100
SYMBOL res 3520 1776 R90
WINDOW 0 0 56 VBottom 2
WINDOW 3 32 56 VTop 2
SYMATTR InstName R61
SYMATTR Value 1k
SYMBOL res 4528 1776 R90
WINDOW 0 0 56 VBottom 2
WINDOW 3 32 56 VTop 2
SYMATTR InstName R62
SYMATTR Value 1k
SYMBOL res 4336 1120 R90
WINDOW 0 0 56 VBottom 2
WINDOW 3 32 56 VTop 2
SYMATTR InstName R63
SYMATTR Value 5k
SYMBOL res 3696 1120 R90
WINDOW 0 0 56 VBottom 2
WINDOW 3 32 56 VTop 2
SYMATTR InstName R64
SYMATTR Value 5k
SYMBOL npn 3776 2448 R0
SYMATTR InstName Q65
SYMATTR Value 2N2222
SYMBOL npn 3776 2736 R0
SYMATTR InstName Q66
SYMATTR Value 2N2222
SYMBOL npn 3584 2832 R0
SYMATTR InstName Q67
SYMATTR Value 2N2222
SYMBOL npn 3584 3104 R0
SYMATTR InstName Q68
SYMATTR Value 2N2222
SYMBOL npn 4176 2448 M0
SYMATTR InstName Q69
SYMATTR Value 2N2222
SYMBOL npn 4176 2736 M0
SYMATTR InstName Q70
SYMATTR Value 2N2222
SYMBOL npn 4384 2832 M0
SYMATTR InstName Q71
SYMATTR Value 2N2222
SYMBOL npn 4384 3104 M0
SYMATTR InstName Q72
SYMATTR Value 2N2222
SYMBOL res 3824 2288 R0
SYMATTR InstName R65
SYMATTR Value 100
SYMBOL res 4096 2288 R0
SYMATTR InstName R66
SYMATTR Value 100
SYMBOL res 3632 2640 R0
SYMATTR InstName R67
SYMATTR Value 100
SYMBOL res 4304 2656 R0
SYMATTR InstName R68
SYMATTR Value 100
SYMBOL res 3536 3136 R90
WINDOW 0 0 56 VBottom 2
WINDOW 3 32 56 VTop 2
SYMATTR InstName R69
SYMATTR Value 1k
SYMBOL res 4544 3136 R90
WINDOW 0 0 56 VBottom 2
WINDOW 3 32 56 VTop 2
SYMATTR InstName R70
SYMATTR Value 1k
SYMBOL res 4352 2480 R90
WINDOW 0 0 56 VBottom 2
WINDOW 3 32 56 VTop 2
SYMATTR InstName R71
SYMATTR Value 5k
SYMBOL res 3712 2480 R90
WINDOW 0 0 56 VBottom 2
WINDOW 3 32 56 VTop 2
SYMATTR InstName R72
SYMATTR Value 5k
SYMBOL OpAmps\\OP07 5840 1344 R0
SYMATTR InstName U1
SYMBOL OpAmps\\OP07 5824 2608 R0
SYMATTR InstName U2
SYMBOL res 5616 1408 R90
WINDOW 0 0 56 VBottom 2
WINDOW 3 32 56 VTop 2
SYMATTR InstName R73
SYMATTR Value 2k
SYMBOL res 5616 1504 R90
WINDOW 0 0 56 VBottom 2
WINDOW 3 32 56 VTop 2
SYMATTR InstName R74
SYMATTR Value 2k
SYMBOL res 5616 1600 R90
WINDOW 0 0 56 VBottom 2
WINDOW 3 32 56 VTop 2
SYMATTR InstName R75
SYMATTR Value 2k
SYMBOL res 5616 1696 R90
WINDOW 0 0 56 VBottom 2
WINDOW 3 32 56 VTop 2
SYMATTR InstName R76
SYMATTR Value 2k
SYMBOL res 5616 1792 R90
WINDOW 0 0 56 VBottom 2
WINDOW 3 32 56 VTop 2
SYMATTR InstName R77
SYMATTR Value 2k
SYMBOL res 5616 1888 R90
WINDOW 0 0 56 VBottom 2
WINDOW 3 32 56 VTop 2
SYMATTR InstName R78
SYMATTR Value 2k
SYMBOL res 5616 1984 R90
WINDOW 0 0 56 VBottom 2
WINDOW 3 32 56 VTop 2
SYMATTR InstName R79
SYMATTR Value 2k
SYMBOL res 5616 2080 R90
WINDOW 0 0 56 VBottom 2
WINDOW 3 32 56 VTop 2
SYMATTR InstName R80
SYMATTR Value 2k
SYMBOL res 5632 1424 R0
SYMATTR InstName R81
SYMATTR Value 1k
SYMBOL res 5632 1520 R0
SYMATTR InstName R82
SYMATTR Value 1k
SYMBOL res 5632 1616 R0
SYMATTR InstName R83
SYMATTR Value 1k
SYMBOL res 5632 1712 R0
SYMATTR InstName R84
SYMATTR Value 1k
SYMBOL res 5632 1808 R0
SYMATTR InstName R85
SYMATTR Value 1k
SYMBOL res 5632 1904 R0
SYMATTR InstName R86
SYMATTR Value 1k
SYMBOL res 5632 2000 R0
SYMATTR InstName R87
SYMATTR Value 1k
SYMBOL res 5632 2112 R0
SYMATTR InstName R88
SYMATTR Value 2k
SYMBOL res 5600 2672 R90
WINDOW 0 0 56 VBottom 2
WINDOW 3 32 56 VTop 2
SYMATTR InstName R89
SYMATTR Value 2k
SYMBOL res 5600 2768 R90
WINDOW 0 0 56 VBottom 2
WINDOW 3 32 56 VTop 2
SYMATTR InstName R90
SYMATTR Value 2k
SYMBOL res 5600 2864 R90
WINDOW 0 0 56 VBottom 2
WINDOW 3 32 56 VTop 2
SYMATTR InstName R91
SYMATTR Value 2k
SYMBOL res 5600 2960 R90
WINDOW 0 0 56 VBottom 2
WINDOW 3 32 56 VTop 2
SYMATTR InstName R92
SYMATTR Value 2k
SYMBOL res 5600 3056 R90
WINDOW 0 0 56 VBottom 2
WINDOW 3 32 56 VTop 2
SYMATTR InstName R93
SYMATTR Value 2k
SYMBOL res 5600 3152 R90
WINDOW 0 0 56 VBottom 2
WINDOW 3 32 56 VTop 2
SYMATTR InstName R94
SYMATTR Value 2k
SYMBOL res 5600 3248 R90
WINDOW 0 0 56 VBottom 2
WINDOW 3 32 56 VTop 2
SYMATTR InstName R95
SYMATTR Value 2k
SYMBOL res 5600 3344 R90
WINDOW 0 0 56 VBottom 2
WINDOW 3 32 56 VTop 2
SYMATTR InstName R96
SYMATTR Value 2k
SYMBOL res 5616 2688 R0
SYMATTR InstName R97
SYMATTR Value 1k
SYMBOL res 5616 2784 R0
SYMATTR InstName R98
SYMATTR Value 1k
SYMBOL res 5616 2880 R0
SYMATTR InstName R99
SYMATTR Value 1k
SYMBOL res 5616 2976 R0
SYMATTR InstName R100
SYMATTR Value 1k
SYMBOL res 5616 3072 R0
SYMATTR InstName R101
SYMATTR Value 1k
SYMBOL res 5616 3168 R0
SYMATTR InstName R102
SYMATTR Value 1k
SYMBOL res 5616 3264 R0
SYMATTR InstName R103
SYMATTR Value 1k
SYMBOL res 5616 3376 R0
SYMATTR InstName R104
SYMATTR Value 2k
TEXT -792 4000 Left 2 ;D1
TEXT -200 3992 Left 2 ;D2
TEXT 376 3992 Left 2 ;D3
TEXT 936 3992 Left 2 ;D4
TEXT 1552 3992 Left 2 ;D5
TEXT 2136 4000 Left 2 ;D6
TEXT 2704 3992 Left 2 ;D7
TEXT 3264 3992 Left 2 ;D8
TEXT -1032 1816 Left 2 ;D1
TEXT -1016 3128 Left 2 ;D2
TEXT 632 1800 Left 2 ;D3
TEXT 656 3128 Left 2 ;D4
TEXT 2288 1776 Left 2 ;D5
TEXT 2296 3128 Left 2 ;D6
TEXT 3968 1784 Left 2 ;D7
TEXT 3968 3152 Left 2 ;D8
TEXT 5832 2096 Left 5 ;OUTPUT DAC
TEXT 5848 3328 Left 5 ;INPUT DAC
TEXT 4424 3560 Left 2 !.tran 10
TEXT 1256 856 Left 6 ;D FlipFlops
TEXT 1136 4056 Left 6 ;Input Signals
TEXT 1304 592 Left 5 ;Clk and Power Source
RECTANGLE Normal 4928 3392 -1872 704 4
RECTANGLE Normal 3984 4112 -1152 3440 4
RECTANGLE Normal 6288 2272 5184 1184 4
RECTANGLE Normal 6288 3600 5152 2400 4
RECTANGLE Normal 2064 640 1056 -320 4

The netlist it stands for:
* Memory_8Bits_FINAL.asc
Q1 ~D1 D1 0 0 2N2222
R1 +not ~D1 50
V1 D1 0 PWL(0 3 2 3 2.005 0 4 0 4.005 3 8 3 8.005 0 10 0)
V2 +Vdac 0 12
V3 0 -Vdac 12
V4 CLK 0 PWL(0 3 7 3 7.005 0 8 0 8.005 3 10 3)
V5 +not 0 3
V6 +Vcc 0 5
Q2 ~D2 D2 0 0 2N2222
R2 +not ~D2 50
V7 D2 0 PWL(0 3 4 3 4.005 0 5 0 5.005 3 7 3 7.005 0 10 0)
Q3 ~D3 D3 0 0 2N2222
R3 +not ~D3 50
V8 D3 0 PWL(0 0 4 0 4.005 3 5 0 8 0 8.005 3 10 3)
Q4 ~D4 D4 0 0 2N2222
R4 +not ~D4 50
V9 D4 0 PWL(0 3 5 3 5.005 0 7 0 7.005 3 8 3 8.005 0 10 0)
Q5 ~D5 D5 0 0 2N2222
R5 +not ~D5 50
V10 D5 0 PWL(0 0 5 0 5.005 3 9 3 9.005 0)
Q6 ~D6 D6 0 0 2N2222
R6 +not ~D6 50
V11 D6 0 PWL(0 3 4 3 4.005 0 8 0 8.005 3 10 3)
Q7 ~D7 D7 0 0 2N2222
R7 +not ~D7 50
V12 D7 0 PWL(0 0 2 0 2.005 3 4 3 4.005 0 6 0 6.005 3 8 3 8.005 0 10 0)
Q8 ~D8 D8 0 0 2N2222
R8 +not ~D8 50
V13 D8 0 PWL(0 3 3 3 3.005 0 6 0 6.005 3 7 3 7.005 0 10 0)
Q9 Q1 N001 N009 0 2N2222
Q10 N009 N017 0 0 2N2222
Q11 N017 CLK N028 0 2N2222
Q12 N028 N037 0 0 2N2222
Q13 ~Q1 N002 N010 0 2N2222
Q14 N010 N018 0 0 2N2222
Q15 N018 CLK N029 0 2N2222
Q16 N029 N038 0 0 2N2222
R9 +Vcc Q1 100
R10 +Vcc ~Q1 100
R11 +Vcc N017 100
R12 +Vcc N018 100
R13 N037 D1 1k
R14 ~D1 N038 1k
R15 Q1 N002 5k
R16 N001 ~Q1 5k
Q17 Q2 N049 N058 0 2N2222
Q18 N058 N066 0 0 2N2222
Q19 N066 CLK N077 0 2N2222
Q20 N077 N086 0 0 2N2222
Q21 ~Q2 N050 N059 0 2N2222
Q22 N059 N067 0 0 2N2222
Q23 N067 CLK N078 0 2N2222
Q24 N078 N087 0 0 2N2222
R17 +Vcc Q2 100
R18 +Vcc ~Q2 100
R19 +Vcc N066 100
R20 +Vcc N067 100
R21 N086 D2 1k
R22 ~D2 N087 1k
R23 Q2 N050 5k
R24 N049 ~Q2 5k
Q25 Q3 N003 N011 0 2N2222
Q26 N011 N019 0 0 2N2222
Q27 N019 CLK N031 0 2N2222
Q28 N031 N039 0 0 2N2222
Q29 ~Q3 N004 N012 0 2N2222
Q30 N012 N020 0 0 2N2222
Q31 N020 CLK N032 0 2N2222
Q32 N032 N040 0 0 2N2222
R25 +Vcc Q3 100
R26 +Vcc ~Q3 100
R27 +Vcc N019 100
R28 +Vcc N020 100
R29 N039 D3 1k
R30 ~D3 N040 1k
R31 Q3 N004 5k
R32 N003 ~Q3 5k
Q33 Q4 N051 N060 0 2N2222
Q34 N060 N068 0 0 2N2222
Q35 N068 CLK N080 0 2N2222
Q36 N080 N088 0 0 2N2222
Q37 ~Q4 N052 N061 0 2N2222
Q38 N061 N069 0 0 2N2222
Q39 N069 CLK N081 0 2N2222
Q40 N081 N089 0 0 2N2222
R33 +Vcc Q4 100
R34 +Vcc ~Q4 100
R35 +Vcc N068 100
R36 +Vcc N069 100
R37 N088 D4 1k
R38 ~D4 N089 1k
R39 Q4 N052 5k
R40 N051 ~Q4 5k
Q41 Q5 N005 N013 0 2N2222
Q42 N013 N021 0 0 2N2222
Q43 N021 CLK N033 0 2N2222
Q44 N033 N041 0 0 2N2222
Q45 ~Q5 N006 N014 0 2N2222
Q46 N014 N022 0 0 2N2222
Q47 N022 CLK N034 0 2N2222
Q48 N034 N042 0 0 2N2222
R41 +Vcc Q5 100
R42 +Vcc ~Q5 100
R43 +Vcc N021 100
R44 +Vcc N022 100
R45 N041 D5 1k
R46 ~D5 N042 1k
R47 Q5 N006 5k
R48 N005 ~Q5 5k
Q49 Q6 N053 N062 0 2N2222
Q50 N062 N070 0 0 2N2222
Q51 N070 CLK N082 0 2N2222
Q52 N082 N090 0 0 2N2222
Q53 ~Q6 N054 N063 0 2N2222
Q54 N063 N071 0 0 2N2222
Q55 N071 CLK N083 0 2N2222
Q56 N083 N091 0 0 2N2222
R49 +Vcc Q6 100
R50 +Vcc ~Q6 100
R51 +Vcc N070 100
R52 +Vcc N071 100
R53 N090 D6 1k
R54 ~D6 N091 1k
R55 Q6 N054 5k
R56 N053 ~Q6 5k
Q57 Q7 N007 N015 0 2N2222
Q58 N015 N023 0 0 2N2222
Q59 N023 CLK N035 0 2N2222
Q60 N035 N043 0 0 2N2222
Q61 ~Q7 N008 N016 0 2N2222
Q62 N016 N024 0 0 2N2222
Q63 N024 CLK N036 0 2N2222
Q64 N036 N044 0 0 2N2222
R57 +Vcc Q7 100
R58 +Vcc ~Q7 100
R59 +Vcc N023 100
R60 +Vcc N024 100
R61 N043 D7 1k
R62 ~D7 N044 1k
R63 Q7 N008 5k
R64 N007 ~Q7 5k
Q65 Q8 N055 N064 0 2N2222
Q66 N064 N072 0 0 2N2222
Q67 N072 CLK N084 0 2N2222
Q68 N084 N092 0 0 2N2222
Q69 ~Q8 N056 N065 0 2N2222
Q70 N065 N073 0 0 2N2222
Q71 N073 CLK N085 0 2N2222
Q72 N085 N093 0 0 2N2222
R65 +Vcc Q8 100
R66 +Vcc ~Q8 100
R67 +Vcc N072 100
R68 +Vcc N073 100
R69 N092 D8 1k
R70 ~D8 N093 1k
R71 Q8 N056 5k
R72 N055 ~Q8 5k
XU1 N025 OUT +Vdac -Vdac OUT LT1001  ; OP07, pins In+ In- V+ V- OUT
XU2 N057 IN +Vdac -Vdac IN LT1001  ; OP07, pins In+ In- V+ V- OUT
R73 N025 Q8 2k
R74 N026 Q7 2k
R75 N027 Q6 2k
R76 N030 Q5 2k
R77 N045 Q4 2k
R78 N046 Q3 2k
R79 N047 Q2 2k
R80 N048 Q1 2k
R81 N025 N026 1k
R82 N026 N027 1k
R83 N027 N030 1k
R84 N030 N045 1k
R85 N045 N046 1k
R86 N046 N047 1k
R87 N047 N048 1k
R88 N048 0 2k
R89 N057 D8 2k
R90 N074 D7 2k
R91 N075 D6 2k
R92 N076 D5 2k
R93 N079 D4 2k
R94 N094 D3 2k
R95 N095 D2 2k
R96 N096 D1 2k
R97 N057 N074 1k
R98 N074 N075 1k
R99 N075 N076 1k
R100 N076 N079 1k
R101 N079 N094 1k
R102 N094 N095 1k
R103 N095 N096 1k
R104 N096 0 2k
.model NPN NPN
.model PNP PNP
.lib standard.bjt
* D1
* D2
* D3
* D4
* D5
* D6
* D7
* D8
* D1
* D2
* D3
* D4
* D5
* D6
* D7
* D8
* OUTPUT DAC
* INPUT DAC
.tran 10
* D FlipFlops
* Input Signals
* Clk and Power Source
.lib LTC.lib
.backanno
.end